# Altium schematic sheet READ_3.SchDoc: FMC-320U - MODELO A - PCB 1
size A4; SheetNumber: 1; SheetTotal: 2; thisVersion: 1; ThisRevision: 2; ThisRelease: 1
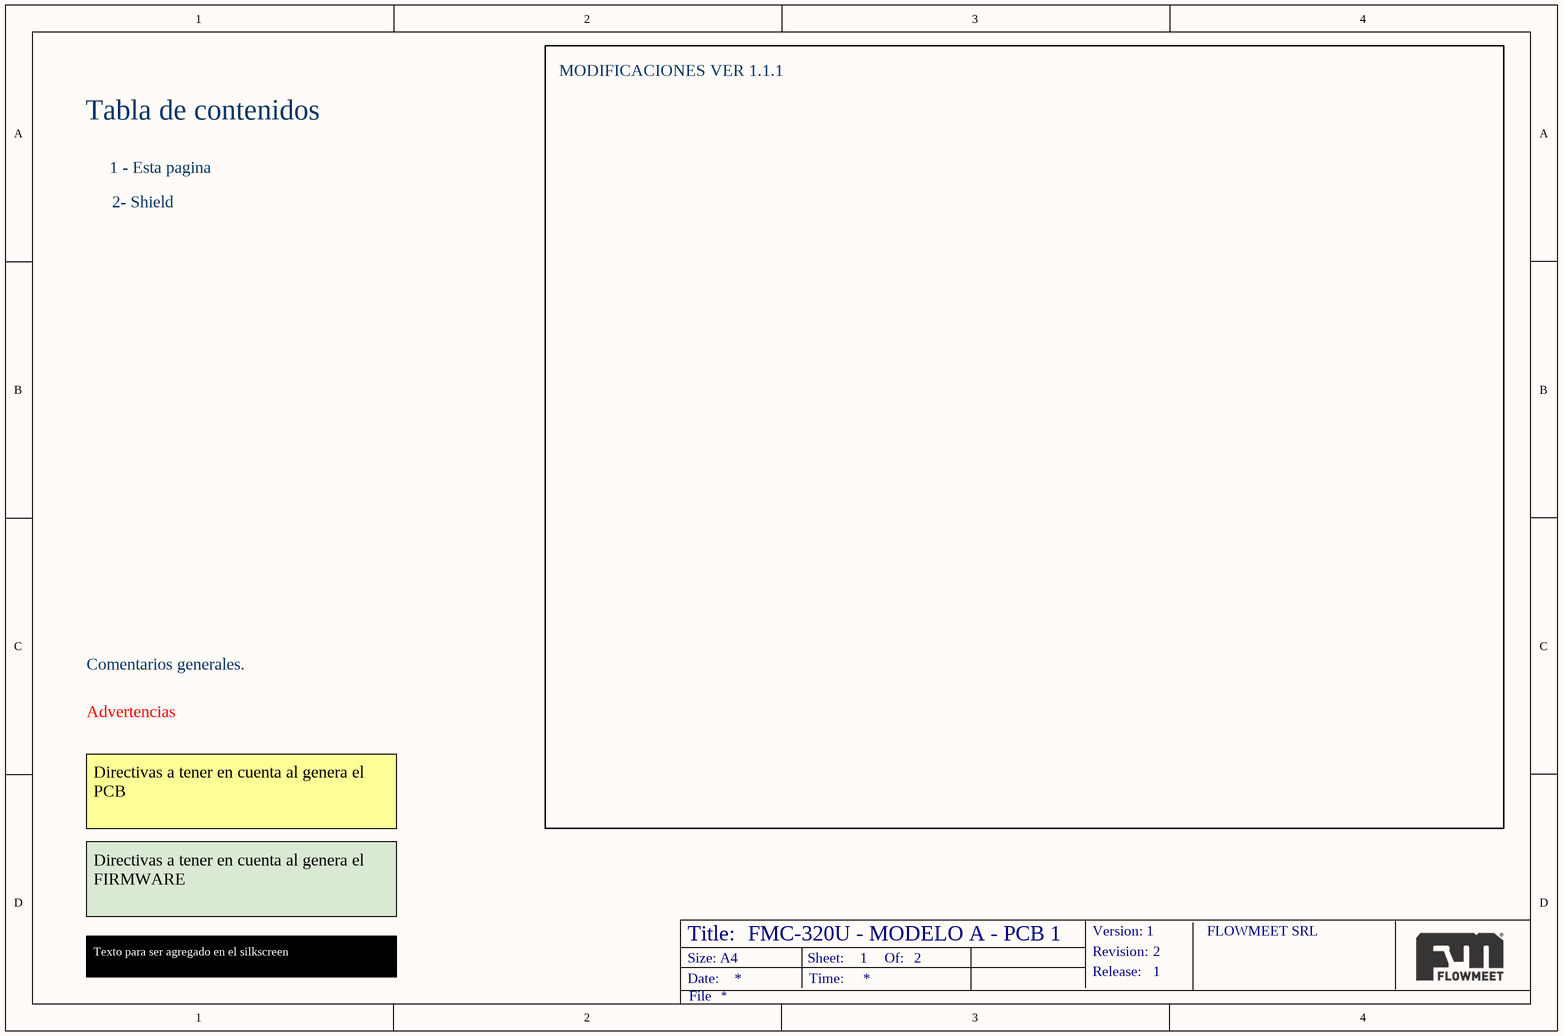
[diagram p0: READ_3.SchDoc]

## Notes on the sheet
- Tabla de contenidos
- 1 - Esta pagina
- 2- Shield
- Comentarios generales.
- Advertencias
- Directivas a tener en cuenta al genera el PCB
- MODIFICACIONES VER 1.1.1
- Directivas a tener en cuenta al genera el FIRMWARE
- Texto para ser agregado en el silkscreen
- Title:
- Size: A4
- Date:
- Sheet:
- Time:
- Of:
- Version:
- Revision:
- Release:
- FLOWMEET SRL
- File